# EasyEDA schematic Receiver Schematic.json
TITLE: Axis Receiver; REV: 1.0; Date: 2020-03-06; Sheet: 1/1; Drawn By: Noa Sendlhofer; Company: NSElectronics
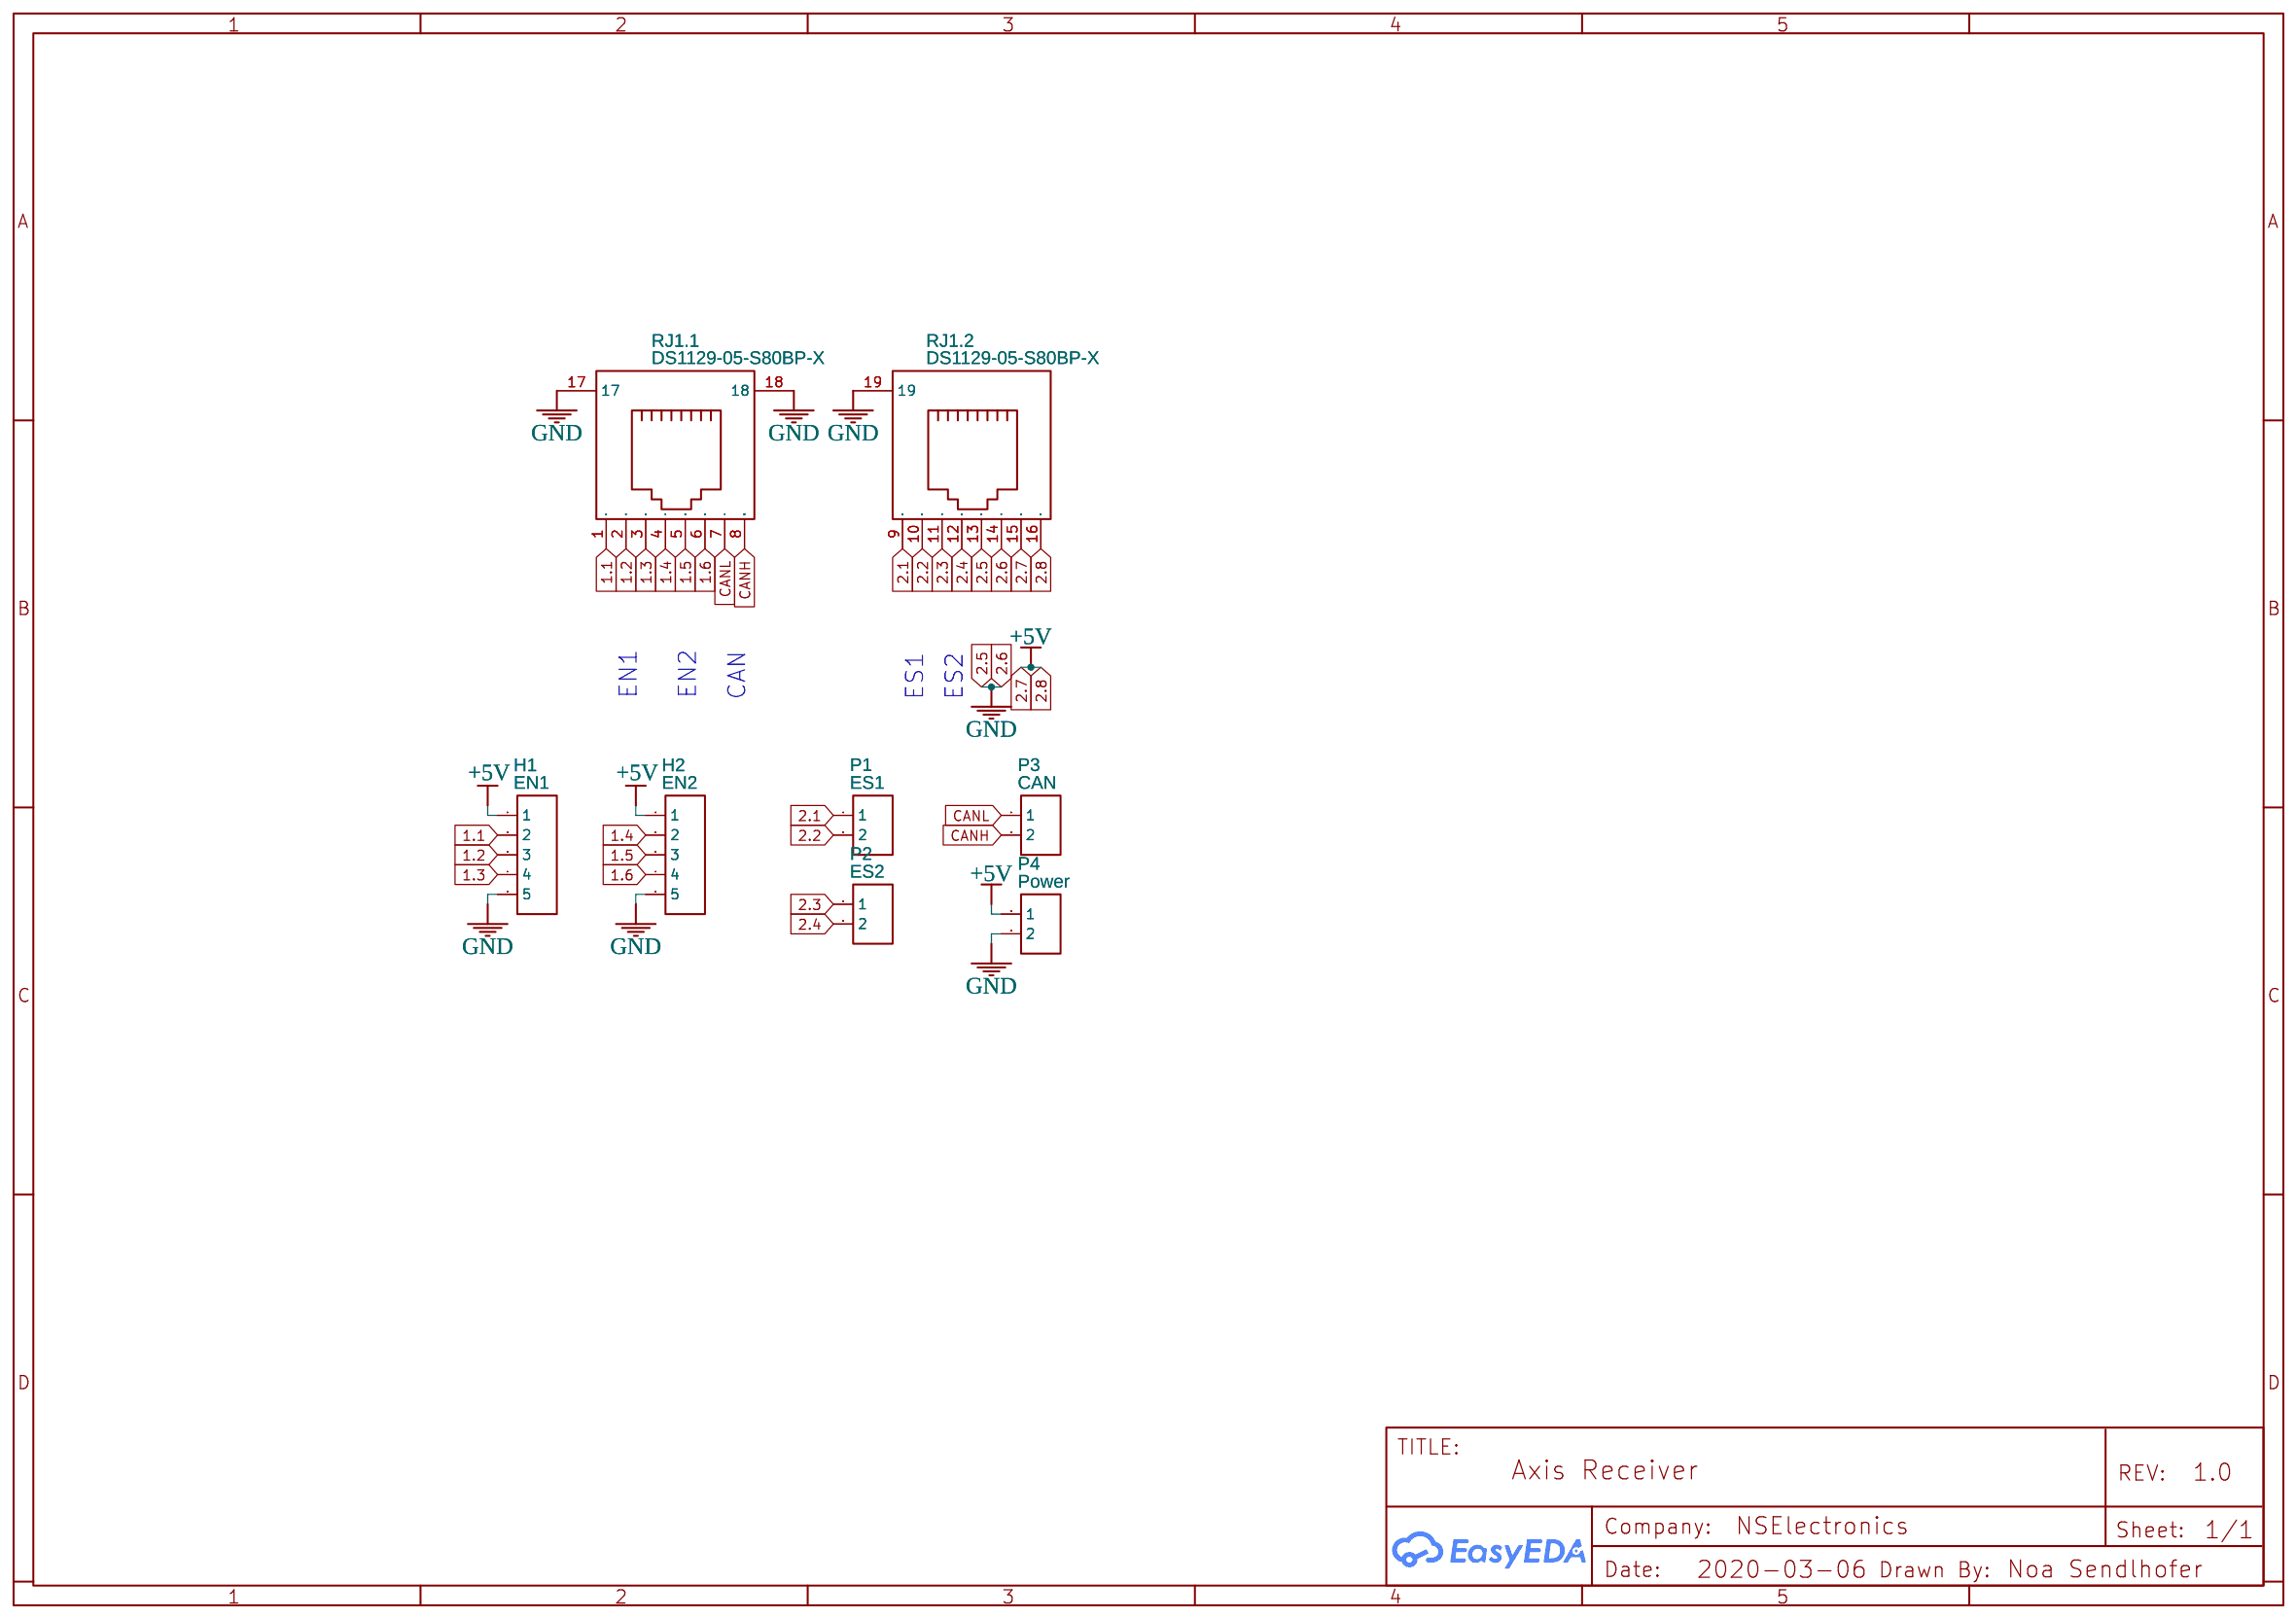
[diagram p0: schematic sheet]

## Parts
H1  EN1  [HDR-5X1/2.54]
H2  EN2  [HDR-5X1/2.54]
P1  ES1  [HDR-TH_2P-P2.54-V-M]
P2  ES2  [HDR-TH_2P-P2.54-V-M]
P3  CAN  [HDR-TH_2P-P2.54-V-M]
P4  Power  [HDR-TH_2P-P2.54-V-M]
RJ1  DS1129-05-S80BP-X  [RJ45-TH_DS1129-05-S80BP-X]  (sections 1,2)

## Library data of the parts
H1 H2 = Header-Female-2.54_1x5: Supplier: LCSC; Manufacturer: BOOMELE; Manufacturer Part: 2.54mm 1*5p Female header; image: //image.lceda.cn/szlcsc/C50950.jpg; Supplier Part: C50950
P1-P4 = Header-Female-2.54_1x2: Supplier: LCSC; Manufacturer: BOOMELE; Manufacturer Part: 2.54-1*2PFemale; image: //image.lceda.cn/szlcsc/C49661.jpg; Supplier Part: C49661
RJ1 = DS1129-05-S80BP-X: Supplier Part: C86580; Supplier: LCSC; Manufacturer: CONNFLY; Manufacturer Part: DS1129-05-S8B0P-X; subpart_no: 1

## Nets
+5V: H1.1 H2.1 P4.1 RJ1.15 RJ1.16
1.1: H1.2 RJ1.1
1.2: H1.3 RJ1.2
1.3: H1.4 RJ1.3
1.4: H2.2 RJ1.4
1.5: H2.3 RJ1.5
1.6: H2.4 RJ1.6
2.1: P1.1 RJ1.9
2.2: P1.2 RJ1.10
2.3: P2.1 RJ1.11
2.4: P2.2 RJ1.12
2.5: H1.5 H2.5 P4.2 RJ1.13 RJ1.14 RJ1.17 RJ1.18 RJ1.19
CANH: P3.2 RJ1.8
CANL: P3.1 RJ1.7

## Notes on the sheet
- EN1
- EN2
- CAN
- ES1
- ES2
